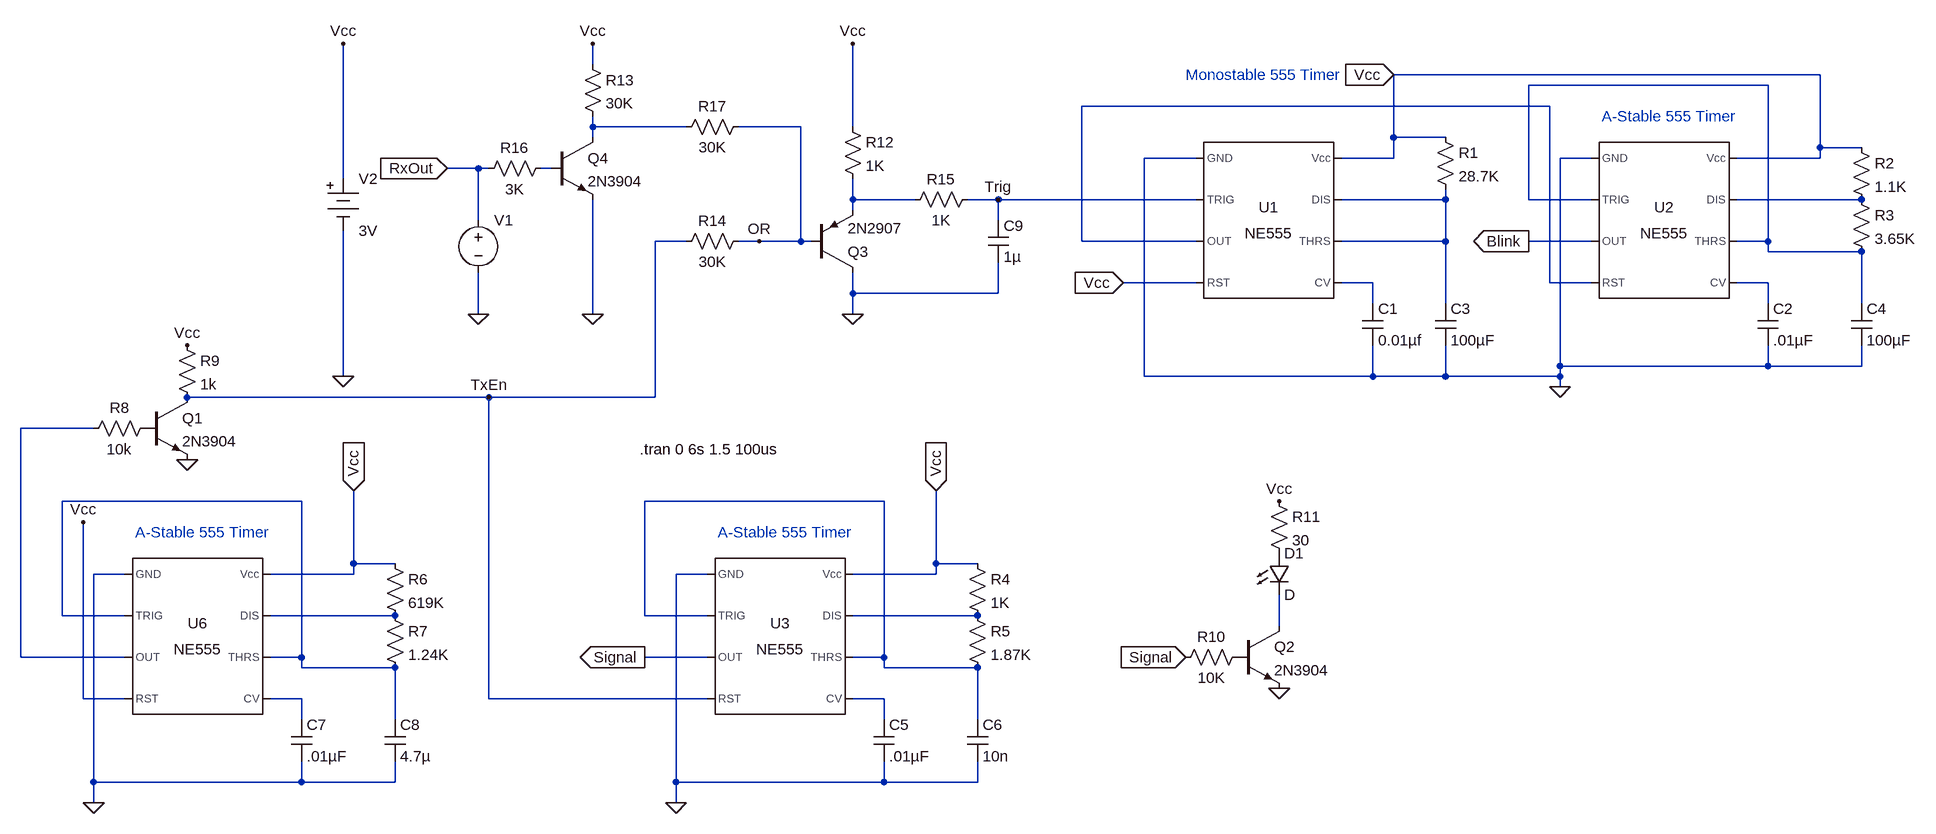
[diagram p0: schematic 555TimerPlan - Babak.asc]
555TimerPlan - Babak.asc, the LTspice schematic file:
Version 4
SHEET 1 1992 1204
WIRE -48 48 -48 16
WIRE 1840 64 1184 64
WIRE 1760 80 1392 80
WIRE 1424 112 704 112
WIRE -48 144 -48 128
WIRE 96 144 -48 144
WIRE 272 144 176 144
WIRE 352 144 352 16
WIRE -48 160 -48 144
WIRE 1184 160 1184 64
WIRE 1264 160 1184 160
WIRE 1840 176 1840 64
WIRE 1904 176 1840 176
WIRE 880 192 800 192
WIRE 1184 192 1184 160
WIRE 1184 192 1104 192
WIRE 1488 192 1440 192
WIRE 1840 192 1840 176
WIRE 1840 192 1712 192
WIRE -224 208 -272 208
WIRE -208 208 -224 208
WIRE -112 208 -128 208
WIRE -432 224 -432 16
WIRE 352 256 352 224
WIRE 448 256 352 256
WIRE 576 256 528 256
WIRE 880 256 576 256
WIRE 1264 256 1264 240
WIRE 1264 256 1104 256
WIRE 1392 256 1392 80
WIRE 1488 256 1392 256
WIRE 1904 256 1712 256
WIRE 352 272 352 256
WIRE -224 288 -224 208
WIRE 576 288 576 256
WIRE 96 320 48 320
WIRE 208 320 176 320
WIRE 272 320 272 144
WIRE 272 320 208 320
WIRE 288 320 272 320
WIRE 704 320 704 112
WIRE 880 320 704 320
WIRE 1264 320 1264 256
WIRE 1264 320 1104 320
WIRE 1488 320 1392 320
WIRE 1760 320 1760 80
WIRE 1760 320 1712 320
WIRE 1760 336 1760 320
WIRE 1904 336 1760 336
WIRE 880 384 768 384
WIRE 1152 384 1104 384
WIRE 1424 384 1424 112
WIRE 1488 384 1424 384
WIRE 1760 384 1712 384
WIRE 352 400 352 368
WIRE 576 400 576 352
WIRE 576 400 352 400
WIRE 1152 416 1152 384
WIRE 1264 416 1264 320
WIRE 1760 416 1760 384
WIRE 1904 416 1904 336
WIRE -224 432 -224 368
WIRE -48 432 -48 256
WIRE 352 432 352 400
WIRE 1440 512 1440 192
WIRE 1760 512 1760 480
WIRE 1760 512 1440 512
WIRE 1904 512 1904 480
WIRE 1904 512 1760 512
WIRE -432 528 -432 304
WIRE 800 528 800 192
WIRE 1152 528 1152 480
WIRE 1152 528 800 528
WIRE 1264 528 1264 480
WIRE 1264 528 1152 528
WIRE 1440 528 1440 512
WIRE 1440 528 1264 528
WIRE 1440 544 1440 528
WIRE -208 560 -672 560
WIRE 48 560 48 320
WIRE 48 560 -208 560
WIRE -816 608 -928 608
WIRE -496 720 -864 720
WIRE 400 720 32 720
WIRE -416 816 -416 704
WIRE -352 816 -416 816
WIRE 480 816 480 704
WIRE 544 816 480 816
WIRE -768 832 -816 832
WIRE -416 832 -416 816
WIRE -416 832 -544 832
WIRE 128 832 80 832
WIRE 480 832 480 816
WIRE 480 832 352 832
WIRE -864 896 -864 720
WIRE -768 896 -864 896
WIRE -352 896 -544 896
WIRE 32 896 32 720
WIRE 128 896 32 896
WIRE 544 896 352 896
WIRE 1008 912 1008 864
WIRE -928 960 -928 608
WIRE -768 960 -928 960
WIRE -496 960 -496 720
WIRE -496 960 -544 960
WIRE 128 960 32 960
WIRE 400 960 400 720
WIRE 400 960 352 960
WIRE -496 976 -496 960
WIRE -352 976 -496 976
WIRE 400 976 400 960
WIRE 544 976 400 976
WIRE -832 1024 -832 752
WIRE -768 1024 -832 1024
WIRE -496 1024 -544 1024
WIRE -208 1024 -208 560
WIRE 128 1024 -208 1024
WIRE 400 1024 352 1024
WIRE -496 1056 -496 1024
WIRE -352 1056 -352 976
WIRE 400 1056 400 1024
WIRE 544 1056 544 976
WIRE -816 1152 -816 832
WIRE -496 1152 -496 1120
WIRE -496 1152 -816 1152
WIRE -352 1152 -352 1120
WIRE -352 1152 -496 1152
WIRE 80 1152 80 832
WIRE 400 1152 400 1120
WIRE 400 1152 80 1152
WIRE 544 1152 544 1120
WIRE 544 1152 400 1152
WIRE -816 1184 -816 1152
WIRE 80 1184 80 1152
FLAG 1184 64 Vcc
IOPIN 1184 64 In
FLAG 1440 544 0
FLAG -272 208 RxOut
IOPIN -272 208 In
FLAG -432 528 0
FLAG -432 16 Vcc
FLAG 1392 320 Blink
IOPIN 1392 320 Out
FLAG 80 1184 0
FLAG 32 960 Signal
IOPIN 32 960 Out
FLAG -816 1184 0
FLAG -832 752 Vcc
FLAG 480 704 Vcc
IOPIN 480 704 In
FLAG -416 704 Vcc
IOPIN -416 704 In
FLAG -672 656 0
FLAG -672 480 Vcc
FLAG 1008 1008 0
FLAG 1008 720 Vcc
FLAG 864 960 Signal
IOPIN 864 960 In
FLAG 768 384 Vcc
IOPIN 768 384 In
FLAG 352 432 0
FLAG 352 16 Vcc
FLAG 576 256 Trig
FLAG -208 560 TxEn
FLAG -48 432 0
FLAG -48 16 Vcc
FLAG 208 320 OR
FLAG -224 432 0
SYMBOL Misc/NE555 992 288 R0
SYMATTR InstName U1
SYMBOL Misc/NE555 1600 288 R0
SYMATTR InstName U2
SYMBOL cap 1136 416 R0
SYMATTR InstName C1
SYMATTR Value 0.01µf
SYMBOL cap 1744 416 R0
SYMATTR InstName C2
SYMATTR Value .01µF
SYMBOL cap 1248 416 R0
SYMATTR InstName C3
SYMATTR Value 100µF
SYMBOL res 1248 144 R0
SYMATTR InstName R1
SYMATTR Value 28.7K
SYMBOL res 1888 160 R0
SYMATTR InstName R2
SYMATTR Value 1.1K
SYMBOL res 1888 240 R0
SYMATTR InstName R3
SYMATTR Value 3.65K
SYMBOL cap 1888 416 R0
SYMATTR InstName C4
SYMATTR Value 100µF
SYMBOL voltage -224 272 R0
WINDOW 123 0 0 Left 0
WINDOW 39 0 0 Left 0
WINDOW 3 24 96 Invisible 2
SYMATTR InstName V1
SYMATTR Value PULSE(0 3 2.0373243s 10us 10us 4ms 1910ms 2)
SYMBOL Misc/battery -432 208 R0
SYMATTR InstName V2
SYMATTR Value 3V
SYMBOL Misc/NE555 240 928 R0
SYMATTR InstName U3
SYMBOL cap 384 1056 R0
SYMATTR InstName C5
SYMATTR Value .01µF
SYMBOL res 528 800 R0
SYMATTR InstName R4
SYMATTR Value 1K
SYMBOL res 528 880 R0
SYMATTR InstName R5
SYMATTR Value 1.87K
SYMBOL cap 528 1056 R0
SYMATTR InstName C6
SYMATTR Value 10n
SYMATTR SpiceLine Rser=32.3m Lser=0 mfg="KEMET" pn="C0201C103K9PAC" type="X5R"
SYMBOL Misc/NE555 -656 928 R0
SYMATTR InstName U6
SYMBOL cap -512 1056 R0
SYMATTR InstName C7
SYMATTR Value .01µF
SYMBOL res -368 800 R0
SYMATTR InstName R6
SYMATTR Value 619K
SYMBOL res -368 880 R0
SYMATTR InstName R7
SYMATTR Value 1.24K
SYMBOL cap -368 1056 R0
SYMATTR InstName C8
SYMATTR Value 4.7µ
SYMATTR SpiceLine V=6.3 Irms=0 Rser=0 Lser=0 mfg="Murata" pn="GRM035R60J475ME15" type="X5R"
SYMBOL res -720 592 R90
WINDOW 0 0 56 VBottom 2
WINDOW 3 32 56 VTop 2
SYMATTR InstName R8
SYMATTR Value 10k
SYMBOL npn -736 560 R0
SYMATTR InstName Q1
SYMATTR Value 2N3904
SYMBOL res -688 464 R0
SYMATTR InstName R9
SYMATTR Value 1k
SYMBOL res 960 944 R90
WINDOW 0 0 56 VBottom 2
WINDOW 3 32 56 VTop 2
SYMATTR InstName R10
SYMATTR Value 10K
SYMBOL npn 944 912 R0
SYMATTR InstName Q2
SYMATTR Value 2N3904
SYMBOL res 992 704 R0
SYMATTR InstName R11
SYMATTR Value 30
SYMBOL LED 992 800 R0
SYMATTR InstName D1
SYMBOL res 336 128 R0
SYMATTR InstName R12
SYMATTR Value 1K
SYMBOL res -64 32 R0
SYMATTR InstName R13
SYMATTR Value 30K
SYMBOL res 192 304 R90
WINDOW 0 0 56 VBottom 2
WINDOW 3 32 56 VTop 2
SYMATTR InstName R14
SYMATTR Value 30K
SYMBOL pnp 288 368 M180
SYMATTR InstName Q3
SYMATTR Value 2N2907
SYMBOL res 544 240 R90
WINDOW 0 0 56 VBottom 2
WINDOW 3 32 56 VTop 2
SYMATTR InstName R15
SYMATTR Value 1K
SYMATTR SpiceLine tol=1 pwr=0.1
SYMBOL cap 560 288 R0
SYMATTR InstName C9
SYMATTR Value 1µ
SYMATTR SpiceLine V=6.3 Irms=0 Rser=0 Lser=0 mfg="Murata" pn="GRM033R60J105MEA2" type="X5R"
SYMBOL res -112 192 R90
WINDOW 0 0 56 VBottom 2
WINDOW 3 32 56 VTop 2
SYMATTR InstName R16
SYMATTR Value 3K
SYMBOL npn -112 160 R0
SYMATTR InstName Q4
SYMATTR Value 2N3904
SYMBOL res 192 128 R90
WINDOW 0 0 56 VBottom 2
WINDOW 3 32 56 VTop 2
SYMATTR InstName R17
SYMATTR Value 30K
TEXT 864 64 Left 2 ;Monostable 555 Timer
TEXT 1504 128 Left 2 ;A-Stable 555 Timer
TEXT 24 640 Left 2 !.tran 0 6s 1.5 100us
TEXT 144 768 Left 2 ;A-Stable 555 Timer
TEXT -752 768 Left 2 ;A-Stable 555 Timer

The netlist it stands for:
* 555TimerPlan - Babak.asc
XU1 0 Trig N002 Vcc N008 N006 N006 Vcc NE555  ; pins GND TRIG OUT RST CV THRS DIS Vcc
XU2 0 N001 Blink N002 N009 N001 N007 Vcc NE555  ; pins GND TRIG OUT RST CV THRS DIS Vcc
C1 N008 0 0.01µf
C2 N009 0 .01µF
C3 N006 0 100µF
R1 Vcc N006 28.7K
R2 Vcc N007 1.1K
R3 N007 N001 3.65K
C4 N001 0 100µF
V1 RxOut 0 PULSE(0 3 2.0373243s 10us 10us 4ms 1910ms 2)
V2 Vcc 0 3V
XU3 0 N012 Signal TxEn N017 N012 N014 Vcc NE555  ; pins GND TRIG OUT RST CV THRS DIS Vcc
C5 N017 0 .01µF
R4 Vcc N014 1K
R5 N014 N012 1.87K
C6 N012 0 10n Rser=32.3m Lser=0 mfg="KEMET" pn="C0201C103K9PAC" type="X5R"
XU6 0 N011 N010 Vcc N016 N011 N013 Vcc NE555  ; pins GND TRIG OUT RST CV THRS DIS Vcc
C7 N016 0 .01µF
R6 Vcc N013 619K
R7 N013 N011 1.24K
C8 N011 0 4.7µ V=6.3 Irms=0 Rser=0 Lser=0 mfg="Murata" pn="GRM035R60J475ME15" type="X5R"
R8 P001 N010 10k
Q1 TxEn P001 0 0 2N3904
R9 Vcc TxEn 1k
R10 P002 Signal 10K
Q2 N015 P002 0 0 2N3904
R11 Vcc P003 30
D1 P003 N015 D
R12 Vcc N005 1K
R13 Vcc N003 30K
R14 OR TxEn 30K
Q3 0 OR N005 0 2N2907
R15 Trig N005 1K tol=1 pwr=0.1
C9 Trig 0 1µ V=6.3 Irms=0 Rser=0 Lser=0 mfg="Murata" pn="GRM033R60J105MEA2" type="X5R"
R16 N004 RxOut 3K
Q4 N003 N004 0 0 2N3904
R17 OR N003 30K
.model D D
.lib standard.dio
.model NPN NPN
.model PNP PNP
.lib standard.bjt
* Monostable 555 Timer
* A-Stable 555 Timer
.tran 0 6s 1.5 100us
* A-Stable 555 Timer
* A-Stable 555 Timer
.lib NE555.sub
.backanno
.end